# Altium schematic sheet Flow_Pump显示屏.SchDoc
size B; SheetNumber: 4; SheetTotal: 14
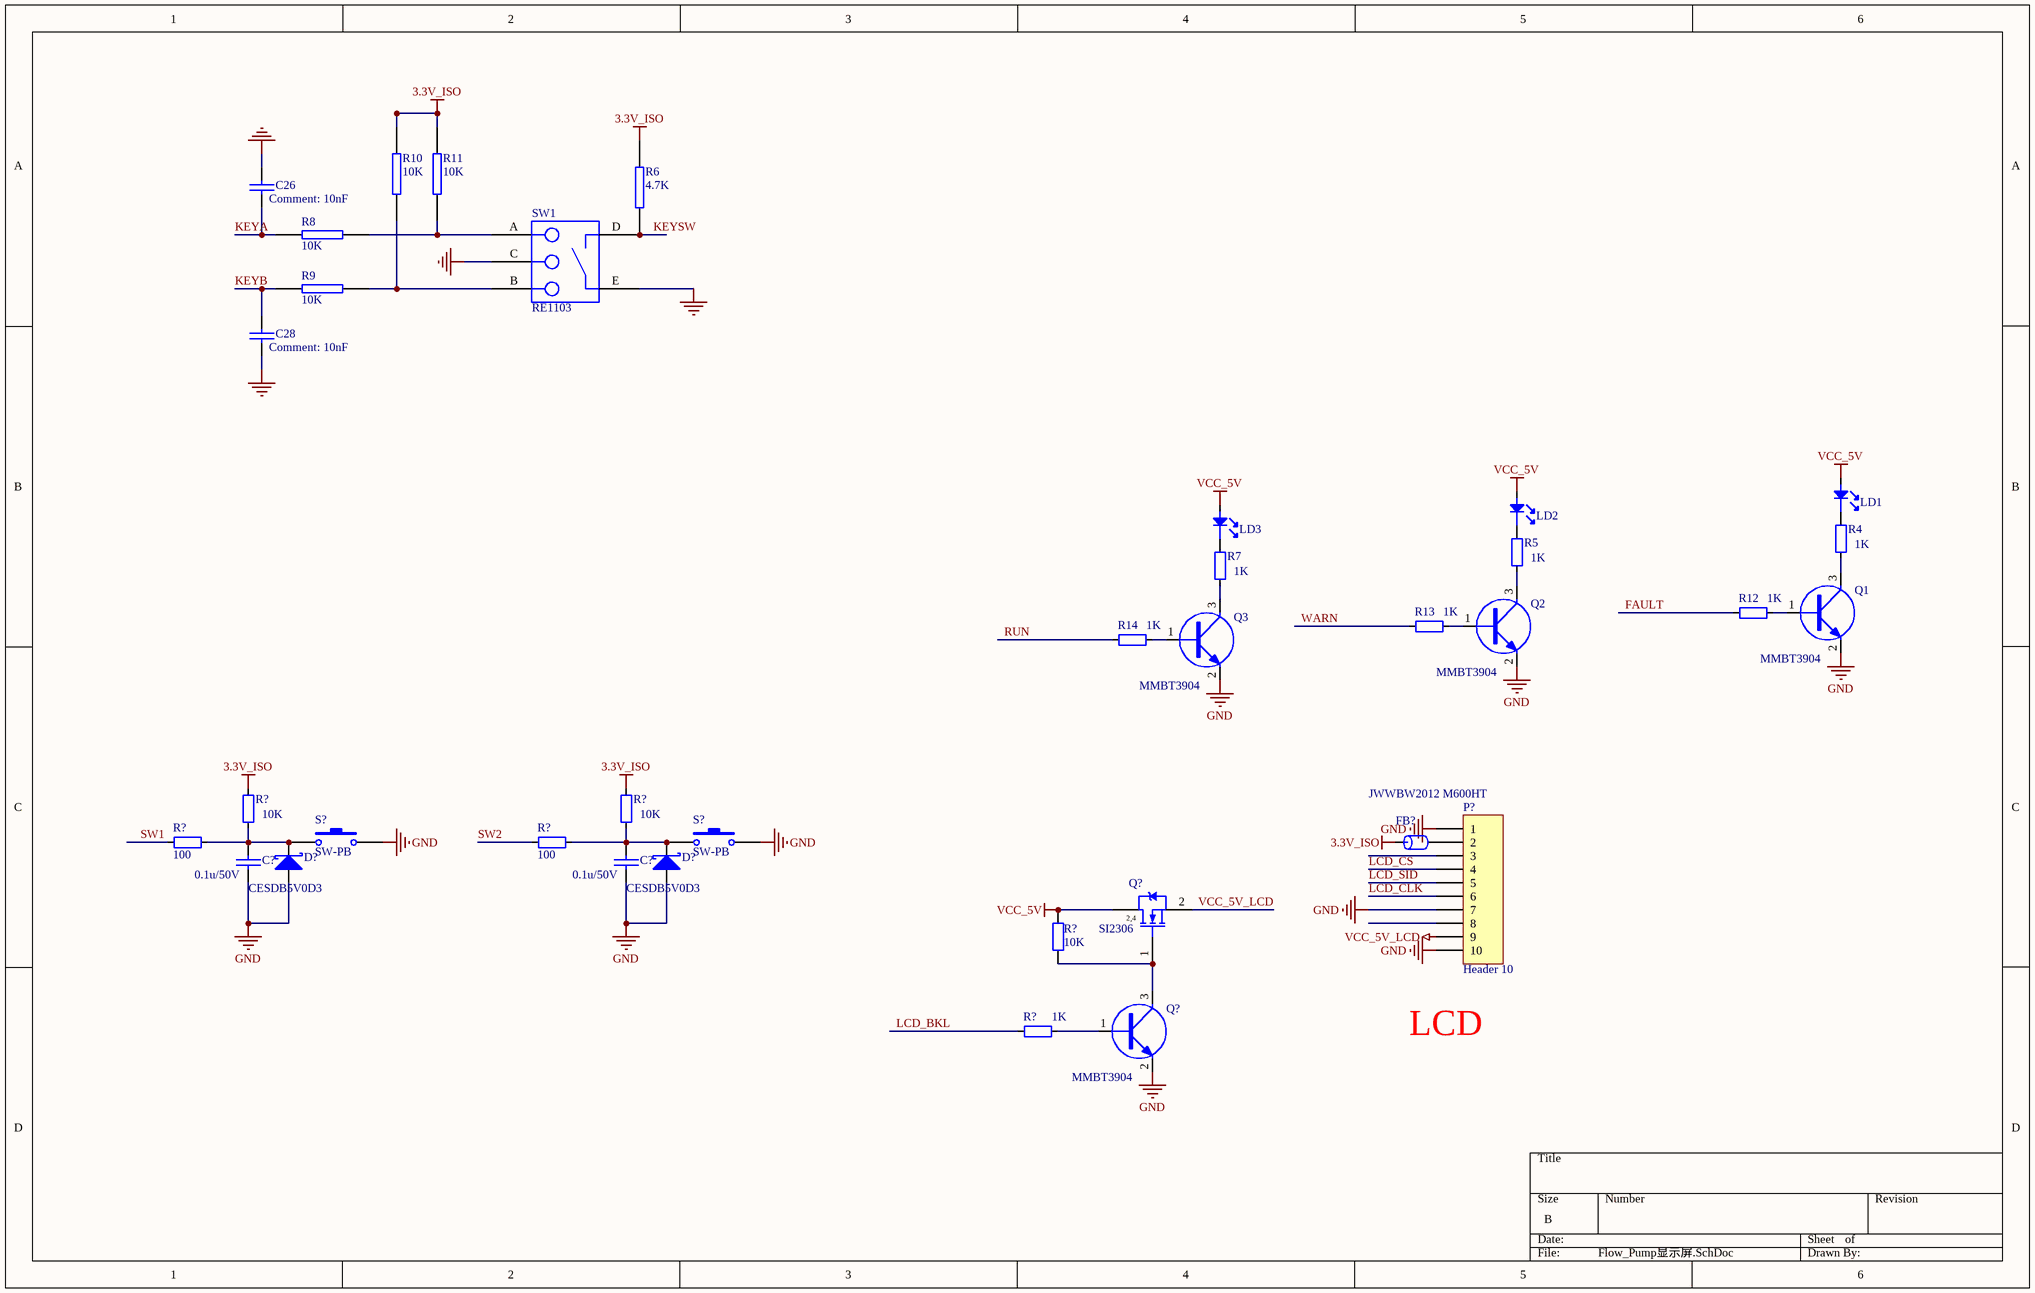
[diagram p0: Flow_Pump显示屏.SchDoc]

## Parts
(Parts that share a designator on the sheet are numbered #1, #2 ... from top to bottom, then left to right.)
C26  10nF  [0603C]
C28  10nF  [0603C]
C?#1  value 0.1u/50V  [0603C]  (hidden comment: 1uF/25V)
C?#2  value 0.1u/50V  [0603C]  (hidden comment: 1uF/25V)
D?#1  CESDB5V0D3  [SOD323]
D?#2  CESDB5V0D3  [SOD323]
FB?  JWWBW2012 M600HT  [0805R]
LD1  LED_Green_19-217  [0603led]  (value not drawn)
LD2  LED_Green_19-217  [0603led]  (value not drawn)
LD3  LED_Green_19-217  [0603led]  (value not drawn)
P?  Header 10  [HDR1X10]
Q1  MMBT3904  [SOT23-3]
Q2  MMBT3904  [SOT23-3]
Q3  MMBT3904  [SOT23-3]
Q?#1  SI2306  [SOT23-3]
Q?#2  MMBT3904  [SOT23-3]
R4  1K  [0603r]
R5  1K  [0603r]
R6  4.7K  [0603R]
R7  1K  [0603r]
R8  10K  [0603R]
R9  10K  [0603R]
R10  10K  [0603R]
R11  10K  [0603R]
R12  1K  [0603r]
R13  1K  [0603r]
R14  1K  [0603r]
R?#1  10K  [0603r]
R?#2  10K  [0603r]
R?#3  100  [0603r]
R?#4  100  [0603r]
R?#5  10K  [0603R]
R?#6  1K  [0603r]
S?#1  SW-PB  [SPST-2]
S?#2  SW-PB  [SPST-2]
SW1  RE1103  [EX1103S-D2-10]

## Nets
3.3V_ISO: FB?.1 R6.1 R10.2 R11.2 R?#1.1 R?#2.1
GND: C26.1 C28.2 C?#1.1 C?#2.1 D?#1.1(A) D?#2.1(A) P?.1 P?.7 P?.10 Q1.2(E) Q2.2(E) Q3.2(E) Q?#2.2(E) S?#1.2 S?#2.2 SW1.C SW1.E
VCC_5V: LD1.1 LD2.1 LD3.1 Q?#1.3(D) R?#5.2
VCC_5V_LCD: P?.9 Q?#1.2(S)
FAULT: R12.1
KEYA: C26.2 R8.1
KEYB: C28.1 R9.1
KEYSW: R6.2 SW1.D
LCD_BKL: R?#6.1
LCD_CLK: P?.6
LCD_CS: P?.4
LCD_SID: P?.5
RUN: R14.1
SW1: R?#3.1
SW2: R?#4.1
WARN: R13.1
NetC?#1_2: C?#1.2 D?#1.2(K) R?#1.2 R?#3.2 S?#1.1
NetC?#2_2: C?#2.2 D?#2.2(K) R?#2.2 R?#4.2 S?#2.1
NetFB?_2: FB?.2 P?.2
NetLD1_2: LD1.2 R4.1
NetLD2_2: LD2.2 R5.1
NetLD3_2: LD3.2 R7.1
NetQ1_1: Q1.1(B) R12.2
NetQ1_3: Q1.3(C) R4.2
NetQ2_1: Q2.1(B) R13.2
NetQ2_3: Q2.3(C) R5.2
NetQ3_1: Q3.1(B) R14.2
NetQ3_3: Q3.3(C) R7.2
NetQ?#1_1: Q?#1.1(G) Q?#2.3(C) R?#5.1
NetQ?#2_1: Q?#2.1(B) R?#6.2
NetR8_2: R8.2 R11.1 SW1.A
NetR9_2: R9.2 R10.1 SW1.B

Not connected (* = marked no-connect by the designer): P? 3 8

## Notes on the sheet
- LCD
- (in symbol BUK92150-55A) 2,4

## Library data of the parts
C26 C28 = CAP: Capacitor
C?#1 C?#2 = CAP
D?#1 D?#2 = DIODE S: Value: 0.1uF/50V
FB? = FB: Part Field 1: 磁珠/0603/1K ohm/100MHz; FB: BLM18BD102SN1(muRata); Text Field1: FB
LD1-LD3 = LED_Green_19-217: 物料主编码(PN): 100000032; Value: 19-217/G7C-AN1P2/3T; ID: 6; 序号: 33; 物料名称: 绿色LED; 物料描述: Other,LED,绿色,0603,1.6X0.8X0.4mm,19-217/G7C-AN1P2/3T; 工作温度: –40°C to 85°C; 制造商: Everlight; 器件等级: ——; 物料类型: 特殊二极管; 规格型号(完整型号): 19-217/G7C-AN1P2/3T
P? = Header 10: Header, 10-Pin; LatestRevisionDate: 17-Jul-2002; LatestRevisionNote: Re-released for DXP Platform.; Publisher: Altium Limited
Q1-Q3 Q?#2 = NPN_MMBT3904
Q?#1 = BUK92150-55A: Published: 8-Jun-2000; LatestRevisionDate: 17-Jul-2002; LatestRevisionNote: Re-released for DXP Platform.; DatasheetVersion: 6-Oct-1997; PackageVersion: Aug-1998; PackageReference: TSOP-6; Publisher: Altium Limited; PackageDescription: SOT-457/SC-74; 6 Leads; Body 3.1 x 3 mm, inc. leads (LxW max); ComponentLink1Description: Manufacturer Link; ComponentLink1URL: http://www.vishay.com/; ComponentLink2Description: Datasheet; ComponentLink2URL: http://www.vishay.com/docs/70192/70192.pdf
R4 R5 R7 R12-R14 R?#6 = RES0603: 物料主编码(PN): 150000040; ID: 233; 序号: 109; 物料名称: 贴片电阻; 精度: ±1%; 规格型号(完整型号): RC1608F103CS/RC0603FR-0710KL; 物料描述: RES,贴片电阻,0603,10k,±1%,1/10W,1.6X0.8X0.45mm,RC1608F103CS/RC0603FR-0710KL; 工作温度: –55°C to 155°C; 制造商: 三星/YAGEO; 器件等级: ——; 物料类型: 表贴电阻; 参数值: 1.00E+04; Value: 1K
R6 R8-R11 = RES2
R?#1-R?#4 = RES0603: 物料主编码(PN): 150000040; Value: 1K; ID: 233; 序号: 109; 物料名称: 贴片电阻; 精度: ±1%; 规格型号(完整型号): RC1608F103CS/RC0603FR-0710KL; 物料描述: RES,贴片电阻,0603,10k,±1%,1/10W,1.6X0.8X0.45mm,RC1608F103CS/RC0603FR-0710KL; 工作温度: –55°C to 155°C; 制造商: 三星/YAGEO; 器件等级: ——; 物料类型: 表贴电阻; 参数值: 1.00E+04
R?#5 = Res2: Resistor; Value: 10R; Published: 8-Jun-2000; LatestRevisionDate: 17-Jul-2002; LatestRevisionNote: Re-released for DXP Platform.; PackageReference: AXIAL-0.4; Publisher: Altium Limited
S?#1 S?#2 = SW-PB: Switch; Published: 24-Mar-1999; LatestRevisionDate: 17-Jul-2002; LatestRevisionNote: Re-released for DXP Platform.; PackageReference: SPST-2; Publisher: Altium Limited